# EAGLE board StearnsN (EAGLE 6.6.0)
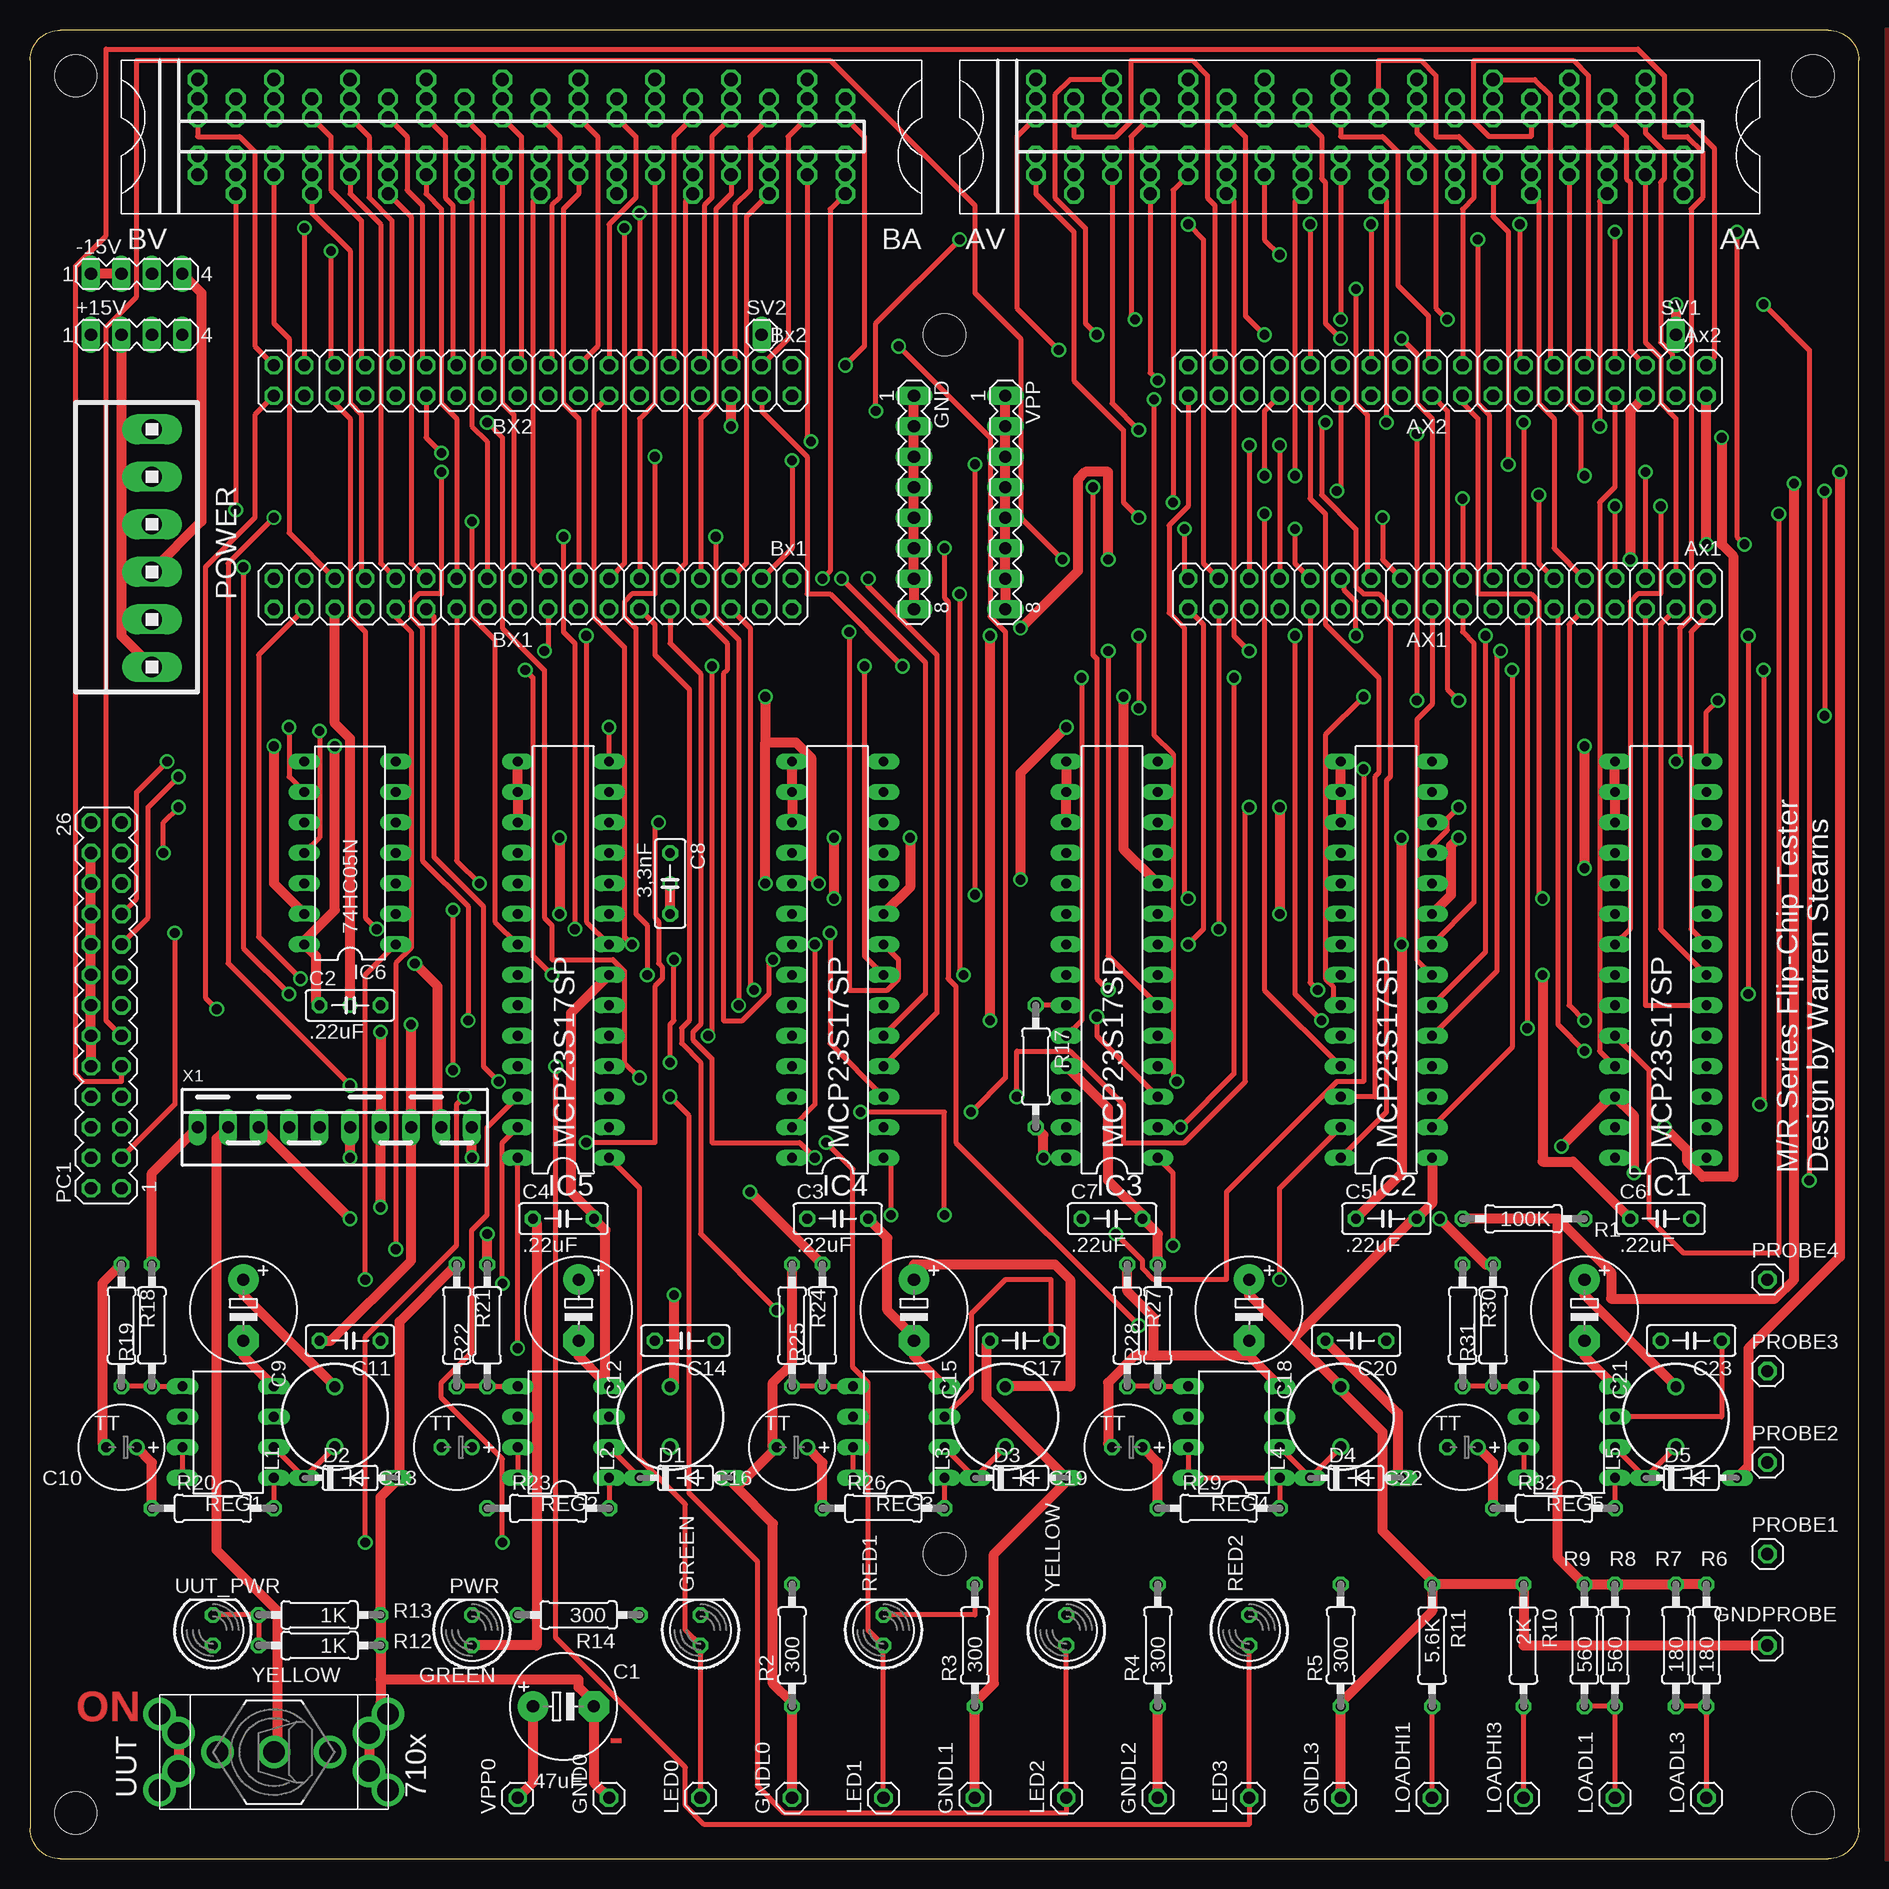
[diagram p1: board, top side]
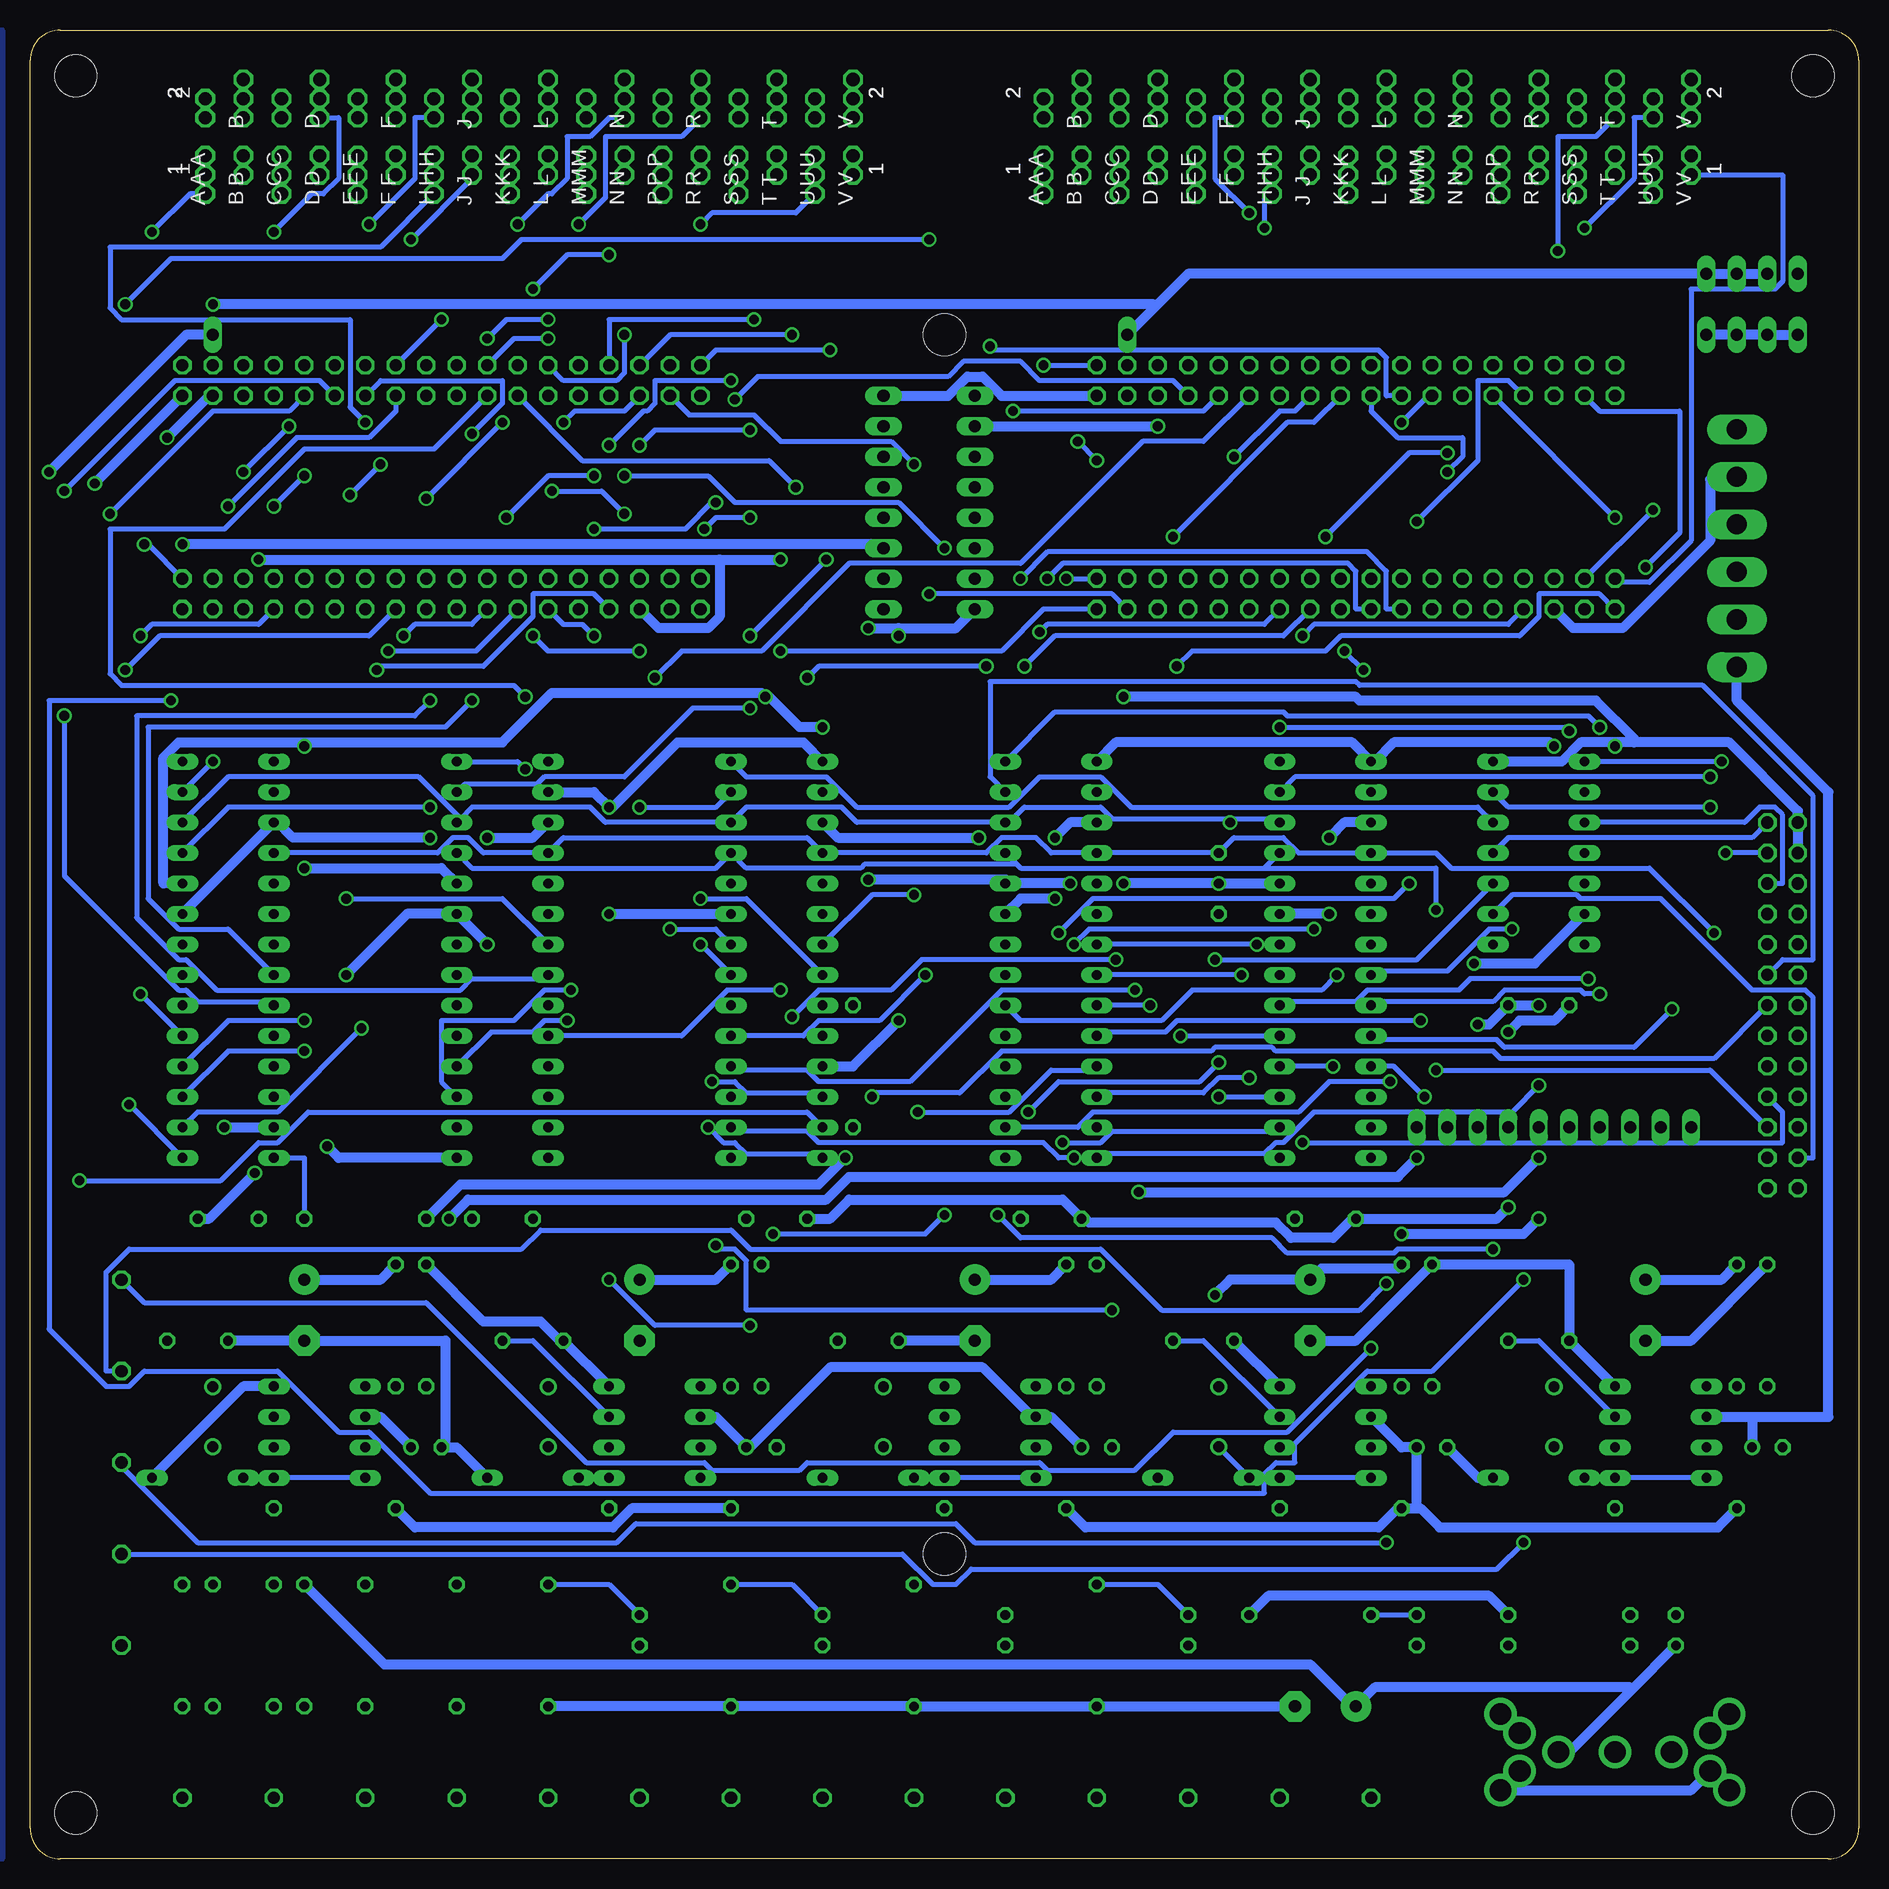
[diagram p2: board, bottom side, seen from below]

Size 152.4 x 152.4 mm. Coordinates in mm from the lower left corner, seen from the top.
Outline: 149.86,152.4 2.54,152.4 arc90 0,149.86 0,2.54 arc90 2.54,0 149.86,0 arc90 152.4,2.54 152.4,149.86 arc90 149.86,152.4
Copper layers (1+16): Top 0.035mm / dielectric 1.5mm / Bottom 0.035mm
Design rules "16mils *": minimum track width 16mil, minimum drill 32mil, track to track 15mil, track to pad 10mil, pad to pad 10mil, via to via 10mil, smd to smd 10mil, copper to edge 13mil, drill to drill 10mil, minimum pad ring 10mil, minimum via ring 8mil, stop-mask expansion 0mil, vias tented up to drill 0mil, thermal gap 10mil
Net classes: 1 Supply: width 0.813 mm
Holes 3.51 mm at 148.59,148.59 3.81,148.59 3.81,3.81 148.59,3.81 76.2,127 76.2,25.4
vRestrict: area 144.8,57.2 to 149.9,87.6

## Footprints (pad centres in the part's own frame; a part is rotated, then mirrored left to right if it is on the bottom)
MA04-1 = drill 1.016 long: 1 -3.81,0; 2 -1.27,0; 3 1.27,0; 4 3.81,0
2X18 = drill 1.016 octagon: 1 -21.59,-1.27; 2 -21.59,1.27; 3 -19.05,-1.27; 4 -19.05,1.27; 5 -16.51,-1.27; 6 -16.51,1.27; 7 -13.97,-1.27; 8 -13.97,1.27; 9 -11.43,-1.27; 10 -11.43,1.27; 11 -8.89,-1.27; 12 -8.89,1.27; 13 -6.35,-1.27; 14 -6.35,1.27; 15 -3.81,-1.27; 16 -3.81,1.27; 17 -1.27,-1.27; 18 -1.27,1.27; 19 1.27,-1.27; 20 1.27,1.27; 21 3.81,-1.27; 22 3.81,1.27; 23 6.35,-1.27; 24 6.35,1.27; 25 8.89,-1.27; 26 8.89,1.27; 27 11.43,-1.27; 28 11.43,1.27; 29 13.97,-1.27; 30 13.97,1.27; 31 16.51,-1.27; 32 16.51,1.27; 33 19.05,-1.27; 34 19.05,1.27; 35 21.59,-1.27; 36 21.59,1.27
E5-8,5 = drill 1.016 pad 2.54: + -2.54,0 | drill 1.016 pad 2.54 octagon: - 2.54,0
C050-025X075 = drill 0.813 octagon: 1 -2.54,0; 2 2.54,0
TT2D7 = drill 0.813: + -1.27,0 | drill 0.813 octagon: - 1.27,0
DO35-7 = drill 0.813 long: A 3.81,0; C -3.81,0
H807-2 = drill 1.092 octagon: AA1 4.763,60.325; AA2 -1.587,60.325; AB1 1.587,57.15; AB2 -4.763,57.15; AC1 4.763,53.975; AC2 -1.587,53.975; AD1 1.587,50.8; AD2 -4.763,50.8; AE1 4.763,47.625; AE2 -1.587,47.625; AF1 1.587,44.45; AF2 -4.763,44.45; AH1 4.763,41.275; AH2 -1.587,41.275; AJ1 1.587,38.1; AJ2 -4.763,38.1; AK1 4.763,34.925; AK2 -1.587,34.925; AL1 1.587,31.75; AL2 -4.763,31.75; AM1 4.763,28.575; AM2 -1.587,28.575; AN1 1.587,25.4; AN2 -4.763,25.4; AP1 4.763,22.225; AP2 -1.587,22.225; AR1 1.587,19.05; AR2 -4.763,19.05; AS1 4.763,15.875; AS2 -1.587,15.875; AT1 1.587,12.7; AT2 -4.763,12.7; AU1 4.763,9.525; AU2 -1.587,9.525; AV1 1.587,6.35; AV2 -4.763,6.35; BA1 4.763,-9.525; BA2 -1.587,-9.525; BB1 1.587,-12.7; BB2 -4.763,-12.7; BC1 4.763,-15.875; BC2 -1.587,-15.875; BD1 1.587,-19.05; BD2 -4.763,-19.05; BE1 4.763,-22.225; BE2 -1.587,-22.225; BF1 1.587,-25.4; BF2 -4.763,-25.4; BH1 4.763,-28.575; BH2 -1.587,-28.575; BJ1 1.587,-31.75; BJ2 -4.763,-31.75; BK1 4.763,-34.925; BK2 -1.587,-34.925; BL1 1.587,-38.1; BL2 -4.763,-38.1; BM1 4.763,-41.275; BM2 -1.587,-41.275; BN1 1.587,-44.45; BN2 -4.763,-44.45; BP1 4.763,-47.625; BP2 -1.587,-47.625; BR1 1.587,-50.8; BR2 -4.763,-50.8; BS1 4.763,-53.975; BS2 -1.587,-53.975; BT1 1.587,-57.15; BT2 -4.763,-57.15; BU1 4.763,-60.325; BU2 -1.587,-60.325; BV1 1.587,-63.5; BV2 -4.763,-63.5
ECS2418-2 = drill 1.092 octagon: AA1 1.587,60.325; AA2 -1.587,60.325; AB1 1.587,57.15; AB2 -1.587,57.15; AC1 1.587,53.975; AC2 -1.587,53.975; AD1 1.587,50.8; AD2 -1.587,50.8; AE1 1.587,47.625; AE2 -1.587,47.625; AF1 1.587,44.45; AF2 -1.587,44.45; AH1 1.587,41.275; AH2 -1.587,41.275; AJ1 1.587,38.1; AJ2 -1.587,38.1; AK1 1.587,34.925; AK2 -1.587,34.925; AL1 1.587,31.75; AL2 -1.587,31.75; AM1 1.587,28.575; AM2 -1.587,28.575; AN1 1.587,25.4; AN2 -1.587,25.4; AP1 1.587,22.225; AP2 -1.587,22.225; AR1 1.587,19.05; AR2 -1.587,19.05; AS1 1.587,15.875; AS2 -1.587,15.875; AT1 1.587,12.7; AT2 -1.587,12.7; AU1 1.587,9.525; AU2 -1.587,9.525; AV1 1.587,6.35; AV2 -1.587,6.35; BA1 1.587,-9.525; BA2 -1.587,-9.525; BB1 1.587,-12.7; BB2 -1.587,-12.7; BC1 1.587,-15.875; BC2 -1.587,-15.875; BD1 1.587,-19.05; BD2 -1.587,-19.05; BE1 1.587,-22.225; BE2 -1.587,-22.225; BF1 1.587,-25.4; BF2 -1.587,-25.4; BH1 1.587,-28.575; BH2 -1.587,-28.575; BJ1 1.587,-31.75; BJ2 -1.587,-31.75; BK1 1.587,-34.925; BK2 -1.587,-34.925; BL1 1.587,-38.1; BL2 -1.587,-38.1; BM1 1.587,-41.275; BM2 -1.587,-41.275; BN1 1.587,-44.45; BN2 -1.587,-44.45; BP1 1.587,-47.625; BP2 -1.587,-47.625; BR1 1.587,-50.8; BR2 -1.587,-50.8; BS1 1.587,-53.975; BS2 -1.587,-53.975; BT1 1.587,-57.15; BT2 -1.587,-57.15; BU1 1.587,-60.325; BU2 -1.587,-60.325; BV1 1.587,-63.5; BV2 -1.587,-63.5
EDAC346-36-2 = drill 1.092 octagon: AA1 3.175,60.325; AA2 -3.175,60.325; AB1 3.175,57.15; AB2 -3.175,57.15; AC1 3.175,53.975; AC2 -3.175,53.975; AD1 3.175,50.8; AD2 -3.175,50.8; AE1 3.175,47.625; AE2 -3.175,47.625; AF1 3.175,44.45; AF2 -3.175,44.45; AH1 3.175,41.275; AH2 -3.175,41.275; AJ1 3.175,38.1; AJ2 -3.175,38.1; AK1 3.175,34.925; AK2 -3.175,34.925; AL1 3.175,31.75; AL2 -3.175,31.75; AM1 3.175,28.575; AM2 -3.175,28.575; AN1 3.175,25.4; AN2 -3.175,25.4; AP1 3.175,22.225; AP2 -3.175,22.225; AR1 3.175,19.05; AR2 -3.175,19.05; AS1 3.175,15.875; AS2 -3.175,15.875; AT1 3.175,12.7; AT2 -3.175,12.7; AU1 3.175,9.525; AU2 -3.175,9.525; AV1 3.175,6.35; AV2 -3.175,6.35; BA1 3.175,-9.525; BA2 -3.175,-9.525; BB1 3.175,-12.7; BB2 -3.175,-12.7; BC1 3.175,-15.875; BC2 -3.175,-15.875; BD1 3.175,-19.05; BD2 -3.175,-19.05; BE1 3.175,-22.225; BE2 -3.175,-22.225; BF1 3.175,-25.4; BF2 -3.175,-25.4; BH1 3.175,-28.575; BH2 -3.175,-28.575; BJ1 3.175,-31.75; BJ2 -3.175,-31.75; BK1 3.175,-34.925; BK2 -3.175,-34.925; BL1 3.175,-38.1; BL2 -3.175,-38.1; BM1 3.175,-41.275; BM2 -3.175,-41.275; BN1 3.175,-44.45; BN2 -3.175,-44.45; BP1 3.175,-47.625; BP2 -3.175,-47.625; BR1 3.175,-50.8; BR2 -3.175,-50.8; BS1 3.175,-53.975; BS2 -3.175,-53.975; BT1 3.175,-57.15; BT2 -3.175,-57.15; BU1 3.175,-60.325; BU2 -3.175,-60.325; BV1 3.175,-63.5; BV2 -3.175,-63.5
MA08-1 = drill 1.016 long: 1 -8.89,0; 2 -6.35,0; 3 -3.81,0; 4 -1.27,0; 5 1.27,0; 6 3.81,0; 7 6.35,0; 8 8.89,0
1X01 = drill 1.016 octagon: 1 0,0
LED5MM = drill 0.813 octagon: A -1.27,0; K 1.27,0
DIL28-3 = drill 0.813 long: 1 -16.51,-3.81; 2 -13.97,-3.81; 3 -11.43,-3.81; 4 -8.89,-3.81; 5 -6.35,-3.81; 6 -3.81,-3.81; 7 -1.27,-3.81; 8 1.27,-3.81; 9 3.81,-3.81; 10 6.35,-3.81; 11 8.89,-3.81; 12 11.43,-3.81; 13 13.97,-3.81; 14 16.51,-3.81; 15 16.51,3.81; 16 13.97,3.81; 17 11.43,3.81; 18 8.89,3.81; 19 6.35,3.81; 20 3.81,3.81; 21 1.27,3.81; 22 -1.27,3.81; 23 -3.81,3.81; 24 -6.35,3.81; 25 -8.89,3.81; 26 -11.43,3.81; 27 -13.97,3.81; 28 -16.51,3.81
DIL14 = drill 0.813 long: 1 -7.62,-3.81; 2 -5.08,-3.81; 3 -2.54,-3.81; 4 0,-3.81; 5 2.54,-3.81; 6 5.08,-3.81; 7 7.62,-3.81; 8 7.62,3.81; 9 5.08,3.81; 10 2.54,3.81; 11 0,3.81; 12 -2.54,3.81; 13 -5.08,3.81; 14 -7.62,3.81
6000-XXXX-RC = drill 0.9 pad 1.422: 1 -2.5,0; 2 2.5,0
MA13-2 = drill 1.016 octagon: 1 -15.24,-1.27; 2 -15.24,1.27; 3 -12.7,-1.27; 4 -12.7,1.27; 5 -10.16,-1.27; 6 -10.16,1.27; 7 -7.62,-1.27; 8 -7.62,1.27; 9 -5.08,-1.27; 10 -5.08,1.27; 11 -2.54,-1.27; 12 -2.54,1.27; 13 0,-1.27; 14 0,1.27; 15 2.54,-1.27; 16 2.54,1.27; 17 5.08,-1.27; 18 5.08,1.27; 19 7.62,-1.27; 20 7.62,1.27; 21 10.16,-1.27; 22 10.16,1.27; 23 12.7,-1.27; 24 12.7,1.27; 25 15.24,-1.27; 26 15.24,1.27
1X6MTA = drill 1.676 long: 1 9.906,0; 2 5.944,0; 3 1.981,0; 4 -1.981,0; 5 -5.944,0; 6 -9.906,0
0207/10 = drill 0.813 octagon: 1 -5.08,0; 2 5.08,0
DIL08 = drill 0.813 long: 1 -3.81,-3.81; 2 -1.27,-3.81; 3 1.27,-3.81; 4 3.81,-3.81; 5 3.81,3.81; 6 1.27,3.81; 7 -1.27,3.81; 8 -3.81,3.81
MA01-1 = drill 1.016 long: 1 0,0
7109MD9V3 = drill 1.803: 1 0,4.699; 2 0,0; 3 0,-4.699; NC@1 -3.175,9.525; NC@2 -1.587,7.938; NC@3 3.175,9.525; NC@4 1.587,7.938; NC@5 -3.175,-9.525; NC@6 -1.587,-7.938; NC@7 1.587,-7.938; NC@8 3.175,-9.525
22-23-2101 = drill 1 long: 1 -11.43,0; 2 -8.89,0; 3 -6.35,0; 4 -3.81,0; 5 -1.27,0; 6 1.27,0; 7 3.81,0; 8 6.35,0; 9 8.89,0; 10 11.43,0

## Placement (x,y rotation side)
+15V  [MA04-1]  8.89,127 0 top
-15V  [MA04-1]  8.89,132.08 0 top
AX1  Ax1  [2X18]  118.11,105.41 180 top
AX2  Ax2  [2X18]  118.11,123.19 180 top
BX1  Bx1  [2X18]  41.91,105.41 180 top
BX2  Bx2  [2X18]  41.91,123.19 180 top
C1  47uF  [E5-8,5]  44.45,12.7 0 top
C2  .22uF  [C050-025X075]  26.67,71.12 0 top
C3  .22uF  [C050-025X075]  67.31,53.34 0 top
C4  .22uF  [C050-025X075]  44.45,53.34 0 top
C5  .22uF  [C050-025X075]  113.03,53.34 0 top
C6  .22uF  [C050-025X075]  135.89,53.34 0 top
C7  .22uF  [C050-025X075]  90.17,53.34 0 top
C8  3,3nF  [C050-025X075]  53.34,81.28 270 top
C9  470uF  [E5-8,5]  17.78,45.72 270 top
C10  100uF  [TT2D7]  7.62,34.29 180 top
C11  .22uF  [C050-025X075]  26.67,43.18 180 top
C12  470uF  [E5-8,5]  45.72,45.72 270 top
C13  100uF  [TT2D7]  35.56,34.29 180 top
C14  .22uF  [C050-025X075]  54.61,43.18 180 top
C15  470uF  [E5-8,5]  73.66,45.72 270 top
C16  100uF  [TT2D7]  63.5,34.29 180 top
C17  .22uF  [C050-025X075]  82.55,43.18 180 top
C18  470uF  [E5-8,5]  101.6,45.72 270 top
C19  100uF  [TT2D7]  91.44,34.29 180 top
C20  .22uF  [C050-025X075]  110.49,43.18 180 top
C21  470uF  [E5-8,5]  129.54,45.72 270 top
C22  100uF  [TT2D7]  119.38,34.29 180 top
C23  .22uF  [C050-025X075]  138.43,43.18 180 top
D1  1N5819  [DO35-7]  54.61,31.75 0 top
D2  1N5819  [DO35-7]  26.67,31.75 0 top
D3  1N5819  [DO35-7]  82.55,31.75 0 top
D4  1N5819  [DO35-7]  110.49,31.75 0 top
D5  1N5819  [DO35-7]  138.43,31.75 0 top
DEC  W971  [H807-2]  77.47,143.51 270 top
ECS  W971ECS  [ECS2418-2]  77.47,143.51 270 top
EDAC  W971EDAC  [EDAC346-36-2]  77.47,143.51 270 top
GND  [MA08-1]  73.66,113.03 270 top
GND0  [1X01]  48.26,5.08 90 top
GNDL0  [1X01]  63.5,5.08 90 top
GNDL1  [1X01]  78.74,5.08 90 top
GNDL2  [1X01]  93.98,5.08 90 top
GNDL3  [1X01]  109.22,5.08 90 top
GNDPROBE  [1X01]  144.78,17.78 180 top
GREEN  [LED5MM]  55.88,19.05 90 top
IC1  MCP23S17SP  [DIL28-3]  135.89,74.93 90 top
IC2  MCP23S17SP  [DIL28-3]  113.03,74.93 90 top
IC3  MCP23S17SP  [DIL28-3]  90.17,74.93 90 top
IC4  MCP23S17SP  [DIL28-3]  67.31,74.93 90 top
IC5  MCP23S17SP  [DIL28-3]  44.45,74.93 90 top
IC6  74HC05N  [DIL14]  26.67,83.82 90 top
L1  220uH  [6000-XXXX-RC]  25.4,36.83 90 top
L2  220uH  [6000-XXXX-RC]  53.34,36.83 90 top
L3  220uH  [6000-XXXX-RC]  81.28,36.83 90 top
L4  220uH  [6000-XXXX-RC]  109.22,36.83 90 top
L5  220uH  [6000-XXXX-RC]  137.16,36.83 90 top
LED0  [1X01]  55.88,5.08 90 top
LED1  [1X01]  71.12,5.08 90 top
LED2  [1X01]  86.36,5.08 90 top
LED3  [1X01]  101.6,5.08 90 top
LOADHI1  [1X01]  116.84,5.08 90 top
LOADHI3  [1X01]  124.46,5.08 90 top
LOADL1  [1X01]  132.08,5.08 90 top
LOADL3  [1X01]  139.7,5.08 90 top
PC1  [MA13-2]  6.35,71.12 90 top
POWER  [1X6MTA]  10.16,109.22 90 top
PROBE1  [1X01]  144.78,25.4 0 top
PROBE2  [1X01]  144.78,33.02 0 top
PROBE3  [1X01]  144.78,40.64 0 top
PROBE4  [1X01]  144.78,48.26 0 top
PWR  GREEN  [LED5MM]  36.83,19.05 90 top
R1  100K  [0207/10]  124.46,53.34 180 top
R2  300  [0207/10]  63.5,17.78 90 top
R3  300  [0207/10]  78.74,17.78 90 top
R4  300  [0207/10]  93.98,17.78 90 top
R5  300  [0207/10]  109.22,17.78 90 top
R6  180  [0207/10]  139.7,17.78 90 top
R7  180  [0207/10]  137.16,17.78 90 top
R8  560  [0207/10]  132.08,17.78 90 top
R9  560  [0207/10]  129.54,17.78 90 top
R10  2K  [0207/10]  124.46,17.78 270 top
R11  5.6K  [0207/10]  116.84,17.78 270 top
R12  1K  [0207/10]  24.13,17.78 180 top
R13  1K  [0207/10]  24.13,20.32 180 top
R14  300  [0207/10]  45.72,20.32 180 top
R17  100K  [0207/10]  83.82,66.04 270 top
R18  1.2K  [0207/10]  7.62,44.45 270 top
R19  3.6K  [0207/10]  10.16,44.45 90 top
R20  0.33  [0207/10]  15.24,29.21 0 top
R21  1.2K  [0207/10]  35.56,44.45 270 top
R22  8.4K  [0207/10]  38.1,44.45 90 top
R23  0.33  [0207/10]  43.18,29.21 0 top
R24  1.2K  [0207/10]  63.5,44.45 270 top
R25  2K  [0207/10]  66.04,44.45 90 top
R26  0.33  [0207/10]  71.12,29.21 0 top
R27  1.2K  [0207/10]  91.44,44.45 270 top
R28  13.2K  [0207/10]  93.98,44.45 90 top
R29  0.33  [0207/10]  99.06,29.21 0 top
R30  1.2K  [0207/10]  119.38,44.45 270 top
R31  9.8K  [0207/10]  121.92,44.45 90 top
R32  0.33  [0207/10]  127,29.21 0 top
RED1  [LED5MM]  71.12,19.05 90 top
RED2  [LED5MM]  101.6,19.05 90 top
REG1  MC33063/MC34063P  [DIL08]  16.51,35.56 90 top
REG2  MC33063/MC34063P  [DIL08]  44.45,35.56 90 top
REG3  MC33063/MC34063P  [DIL08]  72.39,35.56 90 top
REG4  MC33063/MC34063P  [DIL08]  100.33,35.56 90 top
REG5  MC33063/MC34063P  [DIL08]  128.27,35.56 90 top
SV1  MA01-1  [MA01-1]  137.16,127 0 top
SV2  MA01-1  [MA01-1]  60.96,127 0 top
UUT  710x  [7109MD9V3]  20.32,8.89 90 top
UUT_PWR  YELLOW  [LED5MM]  15.24,19.05 90 top
VPP  [MA08-1]  81.28,113.03 270 top
VPP0  [1X01]  40.64,5.08 90 top
X1  CONFIG  [22-23-2101]  25.4,60.96 0 top
YELLOW  [LED5MM]  86.36,19.05 90 top

## Tracks (layer width: path | path; a pad name or v marks a point on that pad's centre or on a via)
3.5V  (via drill 0.81)
  Top 0.813: C15.+ 73.66,49.53 85.41,49.53 86.68,48.26 86.68,39.37 81.28,39.37 L3.2 | v26.67,58.42 X1.6 | R25.2 v60.01,55.56
  Bottom 0.813: R25.2 67.31,48.26 C15.+ | v26.67,58.42 29.53,55.56 v60.01,55.56
+5V
  Top 0.813: C9.+ 17.78,46.99 25.4,39.37 L1.2 | X1.1 10.16,57.15 R19.2
  Bottom 0.813: R19.2 11.43,48.26 C9.+
+10V  (via drill 0.81)
  Top 0.813: v53.66,46.99 53.66,39.69 53.34,39.37 L2.2 | v26.67,53.34 X1.3 | R22.2 v38.1,52.07
  Bottom 0.813: R22.2 38.42,49.21 44.77,49.21 C12.+ 52.39,48.26 v53.66,46.99 | v26.67,53.34 27.94,52.07 v38.1,52.07
+15V
  Top 0.813: +15V.2 7.62,101.92 10.16,99.38 POWER.6 | C19.+ 93.98,33.02 R29.1 | C22.+ 121.92,33.02 R32.1 | C10.+ 10.16,33.02 R20.1 | C16.+ 66.04,33.02 R26.1
  Bottom 0.813: +15V.1 +15V.2 +15V.3 +15V.4 | R20.1 11.75,27.62 34.92,27.62 36.51,29.21 36.83,29.21 | 36.83,29.21 R23.1 38.42,29.21 40.01,27.62 64.45,27.62 R26.1 | R32.1 120.33,27.62 103.82,27.62 102.23,29.21 R29.1 | POWER.6 10.16,96.52 2.54,88.9 2.54,36.83 8.89,36.83 | REG1.6 8.89,36.83 | C22.+ 123.19,36.83 REG5.6 | REG4.6 95.25,36.83 C19.+ 92.39,34.29 85.72,40.96 73.03,40.96 68.9,36.83 REG3.6 67.31,36.83 C16.+ | 8.89,36.83 C10.+ | 36.83,29.21 C13.+ 38.1,34.29 REG2.6
-3.5V  (via drill 0.81)
  Top 0.813: C21.+ 129.54,46.99 137.16,39.37 L5.2 | v36.83,58.42 X1.10 | v117.47,53.34 121.28,49.53 R31.2
  Bottom 0.813: R31.2 123.19,48.26 C21.+ | v36.83,58.42 38.42,56.83 84.14,56.83 86.04,54.93 115.89,54.93 v117.47,53.34
-15V  (via drill 0.81)
  Top 0.813: REG5.4 129.54,41.91 C21.- | 101.6,41.91 REG4.4 | C18.- 101.6,41.91 | -15V.2 -15V.1 | v137.16,129.54 SV1.1 | -15V.4 14.29,130.49 14.29,111.44 10.16,107.31 POWER.4 | D5.A 143.19,32.7 143.19,42.55 150.81,50.16 v150.81,115.57 | C19.- 89.85,34.61 89.85,39.69 92.08,41.91 93.66,41.91 | 101.6,41.91 93.66,41.91 | R27.1 91.44,47.31 93.66,45.09 93.66,41.91 | D4.A 113.98,32.07 113.98,37.15 C20.2
  Bottom 0.813: D5.A 134.62,39.37 REG5.4 | C23.2 C21.- 117.79,43.18 117.79,34.61 C22.- 116.84,34.29 D4.A | REG4.4 C20.2 108.27,43.18 109.86,44.77 114.62,44.77 R30.1 | 58.58,129.38 55.88,132.08 -15V.4 -15V.3 -15V.2 | 58.58,129.38 SV2.1 | v137.16,129.54 58.74,129.54 58.58,129.38 | v150.81,115.57 139.38,127 SV1.1
AA1J
  Top 0.406: IC1.8 138.43,77.47 138.43,102.23 139.7,103.5 AX1.2
AB1J
  Top 0.406: IC1.7 135.89,77.47 135.89,102.87 AX1.4
AB2J  (via drill 0.81)
  Top 0.813: v136.21,60.96 138.11,59.05 138.11,58.1 139.38,56.83 141.92,56.83 141.92,108.58 140.97,109.54 v140.97,118.43
  Bottom 0.813: v136.21,60.96 IC1.27 | v140.97,118.43 137.48,121.92 AX2.4
AC1J
  Top 0.406: IC1.6 134.62,71.12 AX1.6
AD1J  (via drill 0.81)
  Top 0.406: v143.19,101.92 v143.19,72.07
  Bottom 0.406: v143.19,72.07 IC1.5 | v143.19,101.92 142.24,102.87 133.35,102.87 AX1.8
AD2J
  Top 0.406: IC1.25 130.81,67.31 130.81,113.03 132.08,114.3 AX2.8
AE1J  (via drill 0.81)
  Top 0.406: v129.54,69.85 128.27,71.12 128.27,102.87 AX1.10
  Bottom 0.406: IC1.4 135.89,69.85 v129.54,69.85
AE2J  (via drill 0.81)
  Top 0.406: IC1.24 134.94,65.72 134.94,53.34 137.79,50.48 145.73,50.48 v145.73,112.08
  Bottom 0.406: v145.73,112.08 137.16,120.65 130.81,120.65 AX2.10
AF1J  (via drill 0.81)
  Top 0.406: v129.54,67.31 127.32,69.53 127.32,103.82 AX1.12
  Bottom 0.406: IC1.3 135.89,67.31 v129.54,67.31
AF2J  (via drill 0.81)
  Top 0.406: v149.54,113.98 v149.54,95.25
  Bottom 0.406: IC1.23 132.4,71.44 138.43,71.44 139.38,72.39 140.02,72.39 149.54,81.92 v149.54,95.25 | v149.54,113.98 140.34,123.19 128.27,123.19 AX2.12
AH1J  (via drill 0.81)
  Top 0.406: v124.78,69.22 124.78,103.82 AX1.14
  Bottom 0.406: IC1.2 138.43,62.23 131.76,62.23 v124.78,69.22
AH2J  (via drill 0.81)
  Top 0.406: v115.57,118.75 v115.57,96.52
  Bottom 0.406: IC1.22 135.89,77.47 140.02,77.47 142.56,80.01 142.56,94.3 117.79,94.3 v115.57,96.52 | v115.57,118.75 113.03,121.28 113.03,123.19 123.19,123.19 AX2.14
AJ1J  (via drill 0.81)
  Top 0.406: v144.15,62.87 144.46,63.18 v144.46,99.06
  Bottom 0.406: v144.15,62.87 IC1.1 | v144.46,99.06 141.6,101.92 124.14,101.92 AX1.16
AJ2J  (via drill 0.81)
  Top 0.406: IC1.21 133.35,77.47 133.35,104.78 133.99,105.41 135.89,105.41 v135.89,112.71
  Bottom 0.406: v135.89,112.71 130.18,118.43 124.14,118.43 121.92,120.65 AX2.16
AK1J
  Top 0.406: IC2.8 120.33,79.69 120.33,101.28 119.38,102.23 AX1.18
AK2J  (via drill 0.81)
  Top 0.406: v126.05,80.01 125.73,80.33 125.73,104.78 125.09,105.41 120.65,105.41 120.65,120.02 119.38,121.28 AX2.18
  Bottom 0.406: IC2.21 113.03,80.01 v126.05,80.01
AL1J
  Top 0.406: IC2.7 115.57,74.93 115.57,94.93 116.84,96.2 AX1.20
AL2J  (via drill 0.81)
  Top 0.406: v119.06,96.52 118.11,97.47 118.11,120.65 AX2.20
  Bottom 0.406: IC2.22 109.54,73.34 115.57,73.34 116.52,72.39 136.84,72.39 139.38,74.93 140.02,74.93 143.51,78.42 143.51,95.25 120.33,95.25 v119.06,96.52
AM1J  (via drill 0.81)
  Top 0.406: IC2.6 121.28,75.56 v121.28,101.92
  Bottom 0.406: v121.28,101.92 120.33,102.87 115.57,102.87 AX1.22
AM2J  (via drill 0.81)
  Top 0.406: IC2.23 108.58,71.75 108.58,72.71 107.95,73.34 107.95,93.66 v111.12,96.84
  Bottom 0.406: v111.12,96.84 112.08,97.79 144.78,97.79 145.73,98.74 145.73,110.81 136.21,110.81 129.54,117.47 118.75,117.47 AX2.22
AN1J  (via drill 0.81)
  Top 0.406: IC2.5 122.24,73.98 122.24,100.33 v122.56,100.65
  Bottom 0.406: v122.56,100.65 115.25,100.65 AX1.24
AN2J  (via drill 0.81)
  Top 0.406: v89.85,72.39 88.9,73.34 88.9,100.01 88.58,100.33 v88.58,114.3
  Bottom 0.406: IC2.24 98.11,68.58 94.3,72.39 v89.85,72.39 | v88.58,114.3 90.81,116.52 106.36,116.52 AX2.24
AP1J  (via drill 0.81)
  Top 0.406: v107.63,69.85 105.41,72.07 v105.41,101.92
  Bottom 0.406: IC2.4 113.98,68.9 110.49,68.9 109.54,69.85 v107.63,69.85 | v105.41,101.92 106.36,102.87 107.95,102.87 AX1.26
AP2J  (via drill 0.81)
  Top 0.406: IC2.25 102.87,72.39 v102.87,112.08 | v108.9,113.98 109.22,114.3 AX2.26
  Bottom 0.406: v102.87,112.08 104.78,113.98 v108.9,113.98
AR1J  (via drill 0.81)
  Top 0.406: v107.31,72.39 106.68,73.03 AX1.28
  Bottom 0.406: IC2.3 118.11,64.77 118.11,69.85 112.08,69.85 109.54,72.39 v107.31,72.39
AR2J
  Top 0.406: IC2.26 112.08,63.5 112.08,90.17 112.39,90.49 112.39,98.42 107.95,102.87 107.95,112.08 106.68,113.35 AX2.28
AS1J  (via drill 0.81)
  Top 0.406: IC2.2 123.51,67.63 v123.51,99.06
  Bottom 0.406: v123.51,99.06 123.19,99.38 114.62,99.38 110.49,103.5 110.49,105.41 105.41,105.41 AX1.30
AS2J  (via drill 0.81)
  Top 0.406: IC2.27 104.14,55.88 v104.14,48.26 | v92.39,44.45 77.15,59.69 77.15,72.71 76.52,73.34 76.52,104.78 76.2,105.09 v76.2,109.22 | v102.87,115.25 102.87,120.65 AX2.30
  Bottom 0.406: v104.14,48.26 100.33,44.45 v92.39,44.45 | v76.2,109.22 80.01,113.03 93.66,113.03 95.89,115.25 v102.87,115.25
AT2J  (via drill 0.81)
  Top 0.406: IC2.28 113.03,62.23 113.03,89.85 113.35,90.17 113.35,103.19 113.03,103.5 113.03,104.78 112.39,105.41 111.12,105.41 110.49,106.05 110.49,110.81 107.63,113.67 107.63,119.38 v107.95,119.7
  Bottom 0.406: v107.95,119.7 107,120.65 102.87,120.65 AX2.32
AU1J  (via drill 0.81)
  Top 0.406: AX1.34 v99.06,77.47
  Bottom 0.406: IC3.8 95.25,77.47 v99.06,77.47
AU2J  (via drill 0.81)
  Top 0.406: v78.74,116.2 v78.74,80.33
  Bottom 0.406: IC3.21 82.23,80.33 v78.74,80.33 | v78.74,116.2 80.64,118.11 89.85,118.11 92.08,120.33 97.47,120.33 AX2.34
AV1J  (via drill 0.81)
  Top 0.406: v96.52,76.2 97.79,77.47 97.79,102.87 AX1.36
  Bottom 0.406: v96.52,76.2 IC3.7
AV2J  (via drill 0.81)
  Top 0.406: v96.52,80.01 96.2,80.33 96.2,102.55 94.93,103.82 94.93,111.12 96.52,112.71 AX2.36
  Bottom 0.406: IC3.22 92.71,80.01 v96.52,80.01
BA1J  (via drill 0.81)
  Top 0.406: IC3.6 89.85,75.25 v89.85,100.65
  Bottom 0.406: v89.85,100.65 71.44,100.65 67.94,104.14 BX1.2
BB1J  (via drill 0.81)
  Top 0.406: v77.79,73.66 77.47,73.98 v77.47,105.41
  Bottom 0.406: IC3.5 87.95,68.58 86.68,69.85 81.6,69.85 v77.79,73.66 | v77.47,105.41 62.23,105.41 BX1.4
BB2J  (via drill 0.81)
  Top 0.406: IC3.24 87.63,69.85 v87.63,98.42 | v72.71,99.38 66.67,105.41 64.77,105.41 64.77,116.84 60.96,120.65 BX2.4
  Bottom 0.406: v87.63,98.42 86.68,99.38 v72.71,99.38
BC1J  (via drill 0.81)
  Top 0.406: v60.33,72.39 60.01,72.71 60.01,102.55 BX1.6
  Bottom 0.406: IC3.4 93.66,65.72 87.63,65.72 86.68,64.77 79.06,64.77 71.44,72.39 v60.33,72.39
BD1J  (via drill 0.81)
  Top 0.406: IC3.3 88.9,68.58 v88.9,70.17 | v61.91,74.93 61.59,74.61 61.59,72.07 59.37,69.85 57.78,69.85 57.78,98.74 58.1,99.06 58.1,101.28 55.88,103.5 BX1.8
  Bottom 0.406: v88.9,70.17 86.68,72.39 80.64,72.39 78.11,74.93 v61.91,74.93
BD2J  (via drill 0.81)
  Top 0.406: v95.57,64.77 95.25,65.09 95.25,92.08 93.66,93.66 v93.66,121.6
  Bottom 0.406: IC3.26 86.68,63.82 92.71,63.82 93.66,64.77 v95.57,64.77 | v93.66,121.6 91.76,123.51 75.88,123.51 74.61,124.78 69.85,124.78 68.26,123.19 57.15,123.19 BX2.8
BE1J  (via drill 0.81)
  Top 0.406: v65.41,58.42 64.14,59.69 56.83,59.69 56.83,66.67 55.24,68.26 55.24,68.9 55.88,69.53 55.88,98.74 53.34,101.28 BX1.10
  Bottom 0.406: IC3.2 93.66,60.64 87.63,60.64 86.68,59.69 67.94,59.69 66.67,58.42 v65.41,58.42
BE2J  (via drill 0.81)
  Top 0.406: v148.27,56.52 148.27,125.73 v144.46,129.54 | v77.47,134.94 70.48,127.95 v70.48,120.65
  Bottom 0.406: IC3.27 87.63,62.23 129.22,62.23 131.76,59.69 133.35,59.69 136.53,56.52 v148.27,56.52 | v144.46,129.54 140.65,133.35 113.03,133.35 111.44,134.94 v77.47,134.94 | v70.48,120.65 54.61,120.65 BX2.10
BF1J  (via drill 0.81)
  Top 0.406: IC3.1 95.25,57.15 v95.25,51.12 | v62.23,45.72 55.88,52.07 55.88,66.36 54.29,67.94 54.29,69.22 54.93,69.85 54.93,97.47 52.07,100.33 52.07,102.87 BX1.12
  Bottom 0.406: v95.25,51.12 94.93,50.8 93.66,50.8 92.71,49.85 92.71,45.72 v62.23,45.72
BF2J  (via drill 0.81)
  Top 0.406: v95.89,60.96 100.33,65.41 v100.33,98.42
  Bottom 0.406: IC3.28 86.68,58.74 92.71,58.74 93.66,59.69 94.61,59.69 v95.89,60.96 | v100.33,98.42 98.11,100.65 91.44,100.65 84.14,107.95 69.85,107.95 59.69,118.11 54.61,118.11 BX2.12
BH1J  (via drill 0.81)
  Top 0.406: IC4.8 72.39,74.93 72.39,73.34 71.44,72.39 68.26,72.39 v68.26,102.23
  Bottom 0.406: v68.26,102.23 67.63,102.87 49.53,102.87 BX1.14
BH2J  (via drill 0.81)
  Top 0.406: v50.16,76.2 49.53,76.83 49.53,100.97 46.99,103.5 46.99,120.65 BX2.14
  Bottom 0.406: v50.16,76.2 IC4.21
BJ1J  (via drill 0.81)
  Top 0.406: IC4.7 69.53,75.25 v69.53,99.38
  Bottom 0.406: v69.53,99.38 66.99,101.92 47.94,101.92 BX1.16
BJ2J  (via drill 0.81)
  Top 0.406: v51.44,73.66 51.44,77.79 50.48,78.74 50.48,102.55 49.53,103.5 49.53,104.78 50.16,105.41 52.07,105.41 v52.07,116.84
  Bottom 0.406: v51.44,73.66 IC4.22 | v52.07,116.84 48.26,120.65 46.99,120.65 BX2.16
BK1J  (via drill 0.81)
  Top 0.406: v43.5,73.66 41.91,75.25 41.91,98.42 v41.27,99.06 | v42.86,100.65 43.18,100.97 BX1.18
  Bottom 0.406: IC4.6 69.85,69.85 58.1,69.85 55.56,72.39 44.77,72.39 v43.5,73.66 | v42.86,100.65 v41.27,99.06
BK2J  (via drill 0.81)
  Top 0.406: v59.05,71.12 59.05,101.6 57.15,103.5 v57.15,110.17
  Bottom 0.406: v59.05,71.12 IC4.23 | v57.15,110.17 47.62,119.7 45.4,119.7 BX2.18
BL1J  (via drill 0.81)
  Top 0.406: IC4.5 74.61,72.07 74.61,99.69 v67.63,106.68
  Bottom 0.406: v67.63,106.68 66.36,107.95 42.55,107.95 41.91,107.31 41.91,104.14 BX1.20
BL2J  (via drill 0.81)
  Top 0.406: v36.51,69.85 36.51,79.38 32.7,83.19 32.7,102.55 31.75,103.5 31.75,104.78 32.38,105.41 34.29,105.41 v34.29,115.57
  Bottom 0.406: IC4.24 63.18,68.9 57.78,68.9 56.83,69.85 v36.51,69.85 | v34.29,115.57 33.02,116.84 33.02,118.43 38.42,118.43 40.64,120.65 BX2.20
BM1J  (via drill 0.81)
  Top 0.406: IC4.4 75.56,70.48 75.56,100.33 69.85,106.05 v69.85,106.68
  Bottom 0.406: v69.85,106.68 67.63,108.9 40.96,108.9 39.37,107.31 39.37,104.14 BX1.22
BM2J  (via drill 0.81)
  Top 0.406: v78.42,62.23 81.28,65.09 81.28,102.23 80.01,103.5 80.01,118.43 v72.39,126.05
  Bottom 0.406: IC4.25 63.82,65.72 67.31,65.72 70.8,62.23 v78.42,62.23 | v72.39,126.05 72.07,125.73 40.01,125.73 39.37,125.09 39.37,121.92 BX2.22
BN1J  (via drill 0.81)
  Top 0.406: IC4.3 66.67,67.94 v66.67,77.15 | v37.47,81.28 35.56,83.19 BX1.24
  Bottom 0.406: v66.67,77.15 63.82,80.01 38.73,80.01 v37.47,81.28
BN2J  (via drill 0.81)
  Top 0.406: v50.8,65.09 49.53,66.36 49.53,73.98 48.58,74.93 43.5,74.93 43.5,77.79 42.86,78.42 42.86,99.06 39.37,102.55 39.37,118.43 v38.1,119.7
  Bottom 0.406: IC4.26 63.18,63.82 54.61,63.82 53.34,65.09 v50.8,65.09 | v38.1,119.7 35.88,121.92 BX2.24
BP1J  (via drill 0.81)
  Top 0.406: v39.05,64.77 37.78,66.04 37.78,79.38 33.66,83.5 33.66,103.5 BX1.26
  Bottom 0.406: IC4.2 65.09,60.96 63.82,62.23 46.67,62.23 44.13,64.77 v39.05,64.77
BP2J  (via drill 0.81)
  Top 0.406: IC4.27 65.41,62.87 v65.41,76.2 | v45.4,77.47 45.4,101.28 44.45,102.23 v44.45,110.17 | v34.29,117.16 33.02,118.43 BX2.26
  Bottom 0.406: v65.41,76.2 64.14,77.47 v45.4,77.47 | v44.45,110.17 37.47,117.16 v34.29,117.16
BR1J  (via drill 0.81)
  Top 0.406: IC4.1 71.75,57.78 v71.75,53.66 | v30.48,50.8 30.48,74.61 31.75,75.88 31.75,102.23 30.48,103.5 BX1.28
  Bottom 0.406: v71.75,53.66 69.85,51.75 48.9,51.75 47.62,50.48 38.73,50.48 38.42,50.8 v30.48,50.8
BR2J  (via drill 0.81)
  Top 0.406: v26.67,64.45 16.51,74.61 16.51,107.95 v20.32,111.76
  Bottom 0.406: IC4.28 63.18,58.74 49.53,58.74 48.58,59.69 47.94,59.69 45.4,62.23 28.89,62.23 v26.67,64.45 | BX2.28 v20.32,111.76
BS1J  (via drill 0.81)
  Top 0.406: IC5.8 46.35,78.11 v46.35,101.92
  Bottom 0.406: v46.35,101.92 45.4,102.87 29.21,102.87 BX1.30
BS2J  (via drill 0.81)
  Top 0.406: IC5.21 38.73,78.11 38.73,101.6 36.83,103.5 v36.83,111.44
  Bottom 0.406: v36.83,111.44 31.75,116.52 31.75,123.19 29.21,123.19 BX2.30
BT2J  (via drill 0.81)
  Top 0.406: v28.89,77.47 27.94,78.42 27.94,102.23 26.67,103.5 26.67,120.02 25.4,121.28 BX2.32
  Bottom 0.406: IC5.22 40.32,73.98 34.29,73.98 30.8,77.47 v28.89,77.47
BU1J  (via drill 0.81)
  Top 0.406: v22.54,73.34 19.05,76.83 19.05,100.33 BX1.34
  Bottom 0.406: IC5.6 47.94,71.44 41.91,71.44 40.96,72.39 33.34,72.39 32.38,73.34 v22.54,73.34
BU2J  (via drill 0.81)
  Top 0.406: v21.59,72.07 17.78,75.88 v17.78,107.63
  Bottom 0.406: IC5.23 40.32,71.44 30.48,71.44 29.53,72.39 23.18,72.39 22.86,72.07 v21.59,72.07 | v17.78,107.63 14.92,110.49 14.92,120.65 21.59,120.65 BX2.34
BV1J  (via drill 0.81)
  Top 0.406: v56.52,68.58 56.83,68.9 v56.83,99.38
  Bottom 0.406: v56.52,68.58 IC5.5 | v56.83,99.38 55.56,100.65 44.45,100.65 43.18,101.92 28.26,101.92 26.67,103.5 26.67,105.41 21.59,105.41 BX1.36
BV2J  (via drill 0.81)
  Top 0.406: v15.56,70.8 14.61,71.75 14.61,107.63 18.73,111.76 18.73,120.33 BX2.36
  Bottom 0.406: IC5.24 40.32,68.26 30.16,68.26 29.53,67.63 18.73,67.63 v15.56,70.8
CLK  (via drill 0.81)
  Top 0.406: v46.35,59.69 52.07,59.69 52.07,72.71 52.7,73.34 52.7,74.3 52.39,74.61 52.39,78.11 52.07,78.42 52.07,86.04 v52.39,86.36
  Bottom 0.406: IC5.12 48.58,86.68 52.39,86.68 | 52.39,86.68 62.23,86.68 63.18,87.63 69.53,87.63 70.8,86.36 IC4.12 83.5,86.36 84.77,87.63 92.71,87.63 IC3.12 104.46,86.36 105.73,87.63 115.57,87.63 116.52,86.68 | IC1.12 135.89,90.17 120.02,90.17 116.52,86.68 | 116.52,86.68 IC2.12 | PC1.7 6.35,62.23 6.35,59.69 v46.35,59.69 | 52.39,86.68 v52.39,86.36
CS-N  (via drill 0.81)
  Top 0.406: v119.06,87.63 118.11,86.68 118.11,85.72 116.84,84.45 IC2.11 | v35.24,79.06 v35.24,65.72
  Bottom 0.406: IC2.11 115.57,82.55 95.25,82.55 IC3.11 92.71,82.55 83.19,82.55 82.87,82.87 70.17,82.87 | IC1.11 135.89,87.63 v119.06,87.63 | 49.53,82.55 IC5.11 | 49.53,82.55 69.85,82.55 70.17,82.87 | IC4.11 70.17,82.87 | PC1.5 12.38,65.72 v35.24,65.72 | v35.24,79.06 35.24,82.55 49.53,82.55
DGND  (via drill 0.81)
  Top 0.813: IC3.10 91.12,84.14 v91.12,96.84 | v129.54,92.71 v129.54,82.55 | C8.2 v53.34,81.28 | v65.72,81.28 65.09,81.92 65.09,91.76 63.82,93.03 61.28,93.03 | v61.28,81.28 61.28,93.03 | v32.07,74.61 33.97,72.71 33.97,61.28 X1.9 | PC1.10 PC1.12 PC1.14 PC1.16 PC1.18 PC1.20 PC1.22 PC1.24 | IC6.13 20.32,81.28 v20.32,92.71 | v61.28,96.84 61.28,93.03 | v86.36,94.3 82.55,90.49 v82.55,81.6
  Bottom 0.813: 129.54,93.03 140.02,93.03 141.29,91.76 141.29,81.28 IC1.10 | 129.54,93.03 113.03,93.03 108.9,97.16 91.44,97.16 v91.12,96.84 90.81,96.84 88.27,94.3 v86.36,94.3 | IC2.10 118.11,82.55 v129.54,82.55 | v129.54,92.71 129.54,93.03 | IC5.10 v53.34,81.28 v61.28,81.28 | v65.72,81.28 IC4.10 71.12,81.6 v82.55,81.6 | IC6.13 26.99,74.61 v32.07,74.61 | IC6.7 24.77,91.44 23.18,93.03 20.32,93.03 | 18.73,93.03 10.79,93.03 5.08,87.31 PC1.26 PC1.24 | 18.73,93.03 20.32,93.03 | v20.32,92.71 20.32,93.03 | v61.28,96.84 41.91,96.84 41.59,96.52 21.91,96.52 18.73,93.34 18.73,93.03
GND  (via drill 0.81)
  Top 0.813: v31.75,69.53 X1.8 31.75,49.85 25.08,43.18 C11.2 | REG1.4 17.78,41.91 C9.- | BX1.32 25.4,94.61 26.67,93.34 v26.67,71.12 | 47.78,39.85 45.72,41.91 C12.- | 47.78,39.85 REG2.4 | 47.78,39.85 47.94,40.01 47.94,52.39 C4.2 46.99,53.66 45.09,55.56 45.09,70.48 IC5.7 | UUT.NC@1 UUT.NC@2 UUT.NC@4 UUT.NC@3 | UUT.NC@5 UUT.NC@6 UUT.NC@7 UUT.NC@8 29.84,12.38 29.21,13.02 29.21,14.92 | 29.21,14.92 R12.1 R13.1 29.21,30.16 30.48,31.43 D2.A 30.8,31.75 30.8,44.77 R21.1 | GND.8 GND.7 GND.6 GND.5 GND.4 GND.3 GND.2 GND.1 | v58.42,119.38 BX2.6 | v133.35,108.27 133.35,120.65 AX2.6 | v82.55,102.55 87.31,107.31 87.31,114.94 87.95,115.57 89.85,115.57 v89.85,108.27 | R28.2 93.98,52.07 C7.2 92.71,53.66 89.85,56.52 89.85,62.55 IC3.25 | v133.67,57.15 133.67,61.91 IC1.26 131.76,63.5 v127.64,59.37 | IC2.1 116.84,54.61 C5.2 115.25,53.34 105.25,43.34 | 105.25,43.34 101.6,46.99 C18.+ | 105.25,43.34 109.22,39.37 L4.2 109.22,39.05 112.71,35.56 112.71,27.3 116.84,23.18 R11.1 | GNDL3.1 R5.1 109.22,13.02 116.84,20.64 R11.1 | R11.1 R10.1 124.46,17.78 GNDPROBE.1 | REG3.4 73.66,41.91 C15.- 73.66,43.5 71.44,45.72 71.44,51.75 C3.2 | C17.2 79.69,42.86 79.69,38.42 D3.A 86.36,31.43 80.33,25.4 80.33,14.61 78.74,13.02 R3.1 GNDL1.1 | GND0.1 46.99,6.35 C1.- 46.99,13.02 45.72,14.29 45.72,14.92 29.21,14.92 | GNDL2.1 R4.1 | GNDL0.1 R2.1 63.5,13.02 61.91,14.61 61.91,27.94 58.9,30.96 | 58.9,30.96 58.42,31.43 D1.A | v80.01,69.85 v80.01,101.92 | C10.- 6.03,34.61 6.03,47.94 R18.1 | 58.9,30.96 C16.- 61.91,34.29 61.91,39.69 63.5,41.27 R24.1
  Bottom 0.813: BX1.32 23.81,102.55 19.68,102.55 12.38,109.86 12.38,114.94 10.16,114.94 POWER.2 | v31.75,69.53 30.8,69.53 C2.2 v26.67,71.12 | R18.1 13.97,43.18 C9.- | REG1.4 C11.2 24.13,49.53 R21.1 41.91,43.18 C12.- | REG2.4 C14.2 | UUT.NC@2 13.97,5.71 UUT.NC@5 | R14.1 49.21,21.91 30.8,21.91 R13.1 | GND.2 v58.42,119.38 | AX1.32 100.01,102.55 95.89,102.55 94.93,103.5 94.93,108.27 | v133.35,108.27 94.93,108.27 | GND.8 75.25,102.55 80.01,102.55 | v82.55,102.55 80.01,102.55 | 94.93,108.27 v89.85,108.27 | v133.67,57.15 137.48,53.34 C6.2 | v127.64,59.37 126.68,58.42 IC2.1 | R28.2 95.25,48.26 C18.+ | C15.- C17.2 | C1.- R2.1 R3.1 R4.1 R5.1 | v80.01,69.85 83.82,66.04 IC3.25 | v80.01,101.92 80.01,102.55 | C13.- 31.75,31.75 D2.A
  pour Bottom (isolate 0.406): 307.34,152.4 154.94,152.4 154.94,0 307.34,0
  pour Top (isolate 0.406): 307.34,152.4 154.94,152.4 154.94,0 307.34,0
LED0
  Top 0.406: LED0.1 GREEN.A 54.61,19.05 54.61,29.53 50.8,33.34 50.8,55.88 IC5.1
LED1  (via drill 0.81)
  Top 0.406: LED1.1 RED1.A 69.85,19.05 69.85,39.69 68.58,40.96 68.58,57.47 v66.36,59.69
  Bottom 0.406: IC5.2 48.58,60.64 62.23,60.64 63.18,59.69 v66.36,59.69
LED2  (via drill 0.81)
  Top 0.406: YELLOW.A LED2.1 86.36,3.81 62.87,3.81 60.64,6.03 60.64,24.77 54.93,30.48 54.93,61.91 v53.34,63.5
  Bottom 0.406: v53.34,63.5 IC5.3
LED3  (via drill 0.81)
  Top 0.406: RED2.A LED3.1 101.6,2.86 56.2,2.86 54.61,4.45 54.61,7.62 43.81,18.41 v43.81,66.04
  Bottom 0.406: v43.81,66.04 IC5.4
N$1  (via drill 0.81)
  Top 0.406: ECS.AA1 EDAC.AA1 DEC.AA1 | v142.88,109.54 142.24,110.17 v142.24,135.57
  Bottom 0.406: AX1.1 142.56,109.54 v142.88,109.54 | v142.24,135.57 139.06,138.75 DEC.AA1
N$2  (via drill 0.81)
  Top 0.406: AX1.35 96.2,107 v96.2,110.81 | v92.39,111.76 91.12,113.03 91.12,119.06 87,123.19 87,135.57 83.82,138.75 EDAC.AV1 ECS.AV1
  Bottom 0.406: v96.2,110.81 95.25,111.76 v92.39,111.76
N$3  (via drill 0.81)
  Top 0.406: ECS.AU1 EDAC.AU1 DEC.AU1 | AX1.33 97.79,107.95 97.79,134.94 v96.52,136.21
  Bottom 0.406: v96.52,136.21 95.57,137.16 88.58,137.16 DEC.AU1
N$4  (via drill 0.81)
  Top 0.406: v101.6,117.79 AX1.31 | v92.39,119.06 90.17,121.28 EDAC.AT1 ECS.AT1
  Bottom 0.406: v101.6,117.79 100.33,119.06 v92.39,119.06
N$5  (via drill 0.81)
  Top 0.406: ECS.AS1 EDAC.AS1 DEC.AS1 93.34,123.83 v93.98,123.19 | v104.14,117.79 AX1.29
  Bottom 0.406: v104.14,117.79 101.28,120.65 100.97,120.65 100.33,121.28 100.33,123.19 v93.98,123.19
N$6  (via drill 0.81)
  Top 0.406: AX1.27 105.41,107.95 v105.41,110.81 | v95.25,113.03 95.25,139.06 EDAC.AR1 ECS.AR1
  Bottom 0.406: v105.41,110.81 97.79,110.81 95.57,113.03 v95.25,113.03
N$7  (via drill 0.81)
  Top 0.406: ECS.AP1 EDAC.AP1 DEC.AP1 100.33,138.11 100.33,101.92 v101.6,100.65 | AX1.25 109.54,106.36 109.54,105.73 110.49,104.78 v110.49,101.92
  Bottom 0.406: v110.49,101.92 109.22,100.65 v101.6,100.65
N$8  (via drill 0.81)
  Top 0.406: AX1.23 111.44,107 111.44,120.33 110.49,121.28 v110.49,130.81 | v104.14,133.67 102.87,134.94 EDAC.AN1 ECS.AN1
  Bottom 0.406: v110.49,130.81 107.63,133.67 v104.14,133.67
N$9  (via drill 0.81)
  Top 0.406: ECS.AM1 EDAC.AM1 DEC.AM1 105.41,138.11 v105.41,115.25 | AX1.21 112.71,108.27 v112.71,111.76
  Bottom 0.406: v112.71,111.76 109.22,115.25 v105.41,115.25
N$10  (via drill 0.81)
  Top 0.406: AX1.19 116.84,120.02 115.57,121.28 115.57,125.41 v114.3,126.68 | v109.22,128.27 EDAC.AL1 ECS.AL1
  Bottom 0.406: v114.3,126.68 112.71,128.27 v109.22,128.27
N$11  (via drill 0.81)
  Top 0.406: ECS.AK1 EDAC.AK1 DEC.AK1 113.03,138.11 v113.03,119.7 | v119.38,113.35 AX1.17
  Bottom 0.406: v113.03,119.7 v119.38,113.35
N$12  (via drill 0.81)
  Top 0.406: AX1.15 121.6,107 121.6,120.33 120.65,121.28 v120.65,134.94 | EDAC.AJ1 ECS.AJ1
  Bottom 0.406: v120.65,134.94 115.57,140.02 EDAC.AJ1
N$13  (via drill 0.81)
  Top 0.406: ECS.AH1 EDAC.AH1 DEC.AH1 | v124.46,119.7 AX1.13
  Bottom 0.406: v124.46,119.7 125.73,120.97 125.73,128.27 144.78,128.27 145.73,129.22 145.73,134.3 123.19,134.3 DEC.AH1
N$14  (via drill 0.81)
  Top 0.406: AX1.11 125.73,107.95 v125.73,113.67 | v123.19,116.2 123.19,135.57 121.92,136.84 EDAC.AF1 ECS.AF1
  Bottom 0.406: v123.19,116.2 v125.73,113.67
N$15
  Top 0.406: ECS.AE1 EDAC.AE1 DEC.AE1 125.73,138.11 125.73,121.28 127,120.02 127,109.22 AX1.9
N$16  (via drill 0.81)
  Top 0.406: v132.08,112.71 AX1.7 | v129.54,115.25 129.22,115.57 129.22,120.33 128.27,121.28 EDAC.AD1 ECS.AD1
  Bottom 0.406: v129.54,115.25 v132.08,112.71
N$17  (via drill 0.81)
  Top 0.406: ECS.AC1 EDAC.AC1 DEC.AC1 130.81,138.11 v130.81,119.38 | v134.62,115.57 AX1.5
  Bottom 0.406: v130.81,119.38 v134.62,115.57
N$18
  Top 0.406: AX1.3 137.16,120.02 135.89,121.28 135.89,125.09 134.62,126.36 EDAC.AB1 ECS.AB1
N$19
  Top 0.406: AX2.1 140.34,125.09 140.34,142.56 ECS.AA2 EDAC.AA2
N$20
  Top 0.406: DEC.AB2 EDAC.AB2 ECS.AB2 134.62,143.83 136.21,142.24 136.21,140.02 135.89,139.7 135.89,126.36 136.84,125.41 136.84,124.78 AX2.3
N$21
  Top 0.406: AX2.5 133.35,125.73 133.35,139.7 133.03,140.02 133.03,143.51 ECS.AC2 EDAC.AC2
N$22  (via drill 0.81)
  Top 0.406: DEC.AD2 EDAC.AD2 ECS.AD2 | v132.08,135.57 AX2.7
  Bottom 0.406: v132.08,135.57 128.91,138.75 127.95,138.75 126.68,140.02 126.68,145.1 ECS.AD2
N$23
  Top 0.406: AX2.9 129.86,124.78 129.86,148.59 128.59,149.86 120.33,149.86 120.33,144.78 121.6,143.51 125.09,143.51 ECS.AE2 EDAC.AE2
N$24
  Top 0.406: ECS.AF2 EDAC.AF2 DEC.AF2 125.41,148.27 126.68,147 126.68,124.78 AX2.11
N$25  (via drill 0.81)
  Top 0.406: AX2.13 124.14,124.78 v124.14,136.21 | ECS.AH2 EDAC.AH2
  Bottom 0.406: v124.14,136.21 120.33,140.02 120.33,145.1 ECS.AH2
N$26  (via drill 0.81)
  Top 0.406: DEC.AJ2 EDAC.AJ2 ECS.AJ2 115.57,143.83 117.16,142.24 117.16,129.22 v118.11,128.27
  Bottom 0.406: v118.11,128.27 AX2.15
N$27
  Top 0.406: AX2.17 119.38,137.48 120.33,138.43 120.33,142.24 119.06,143.51 117.16,143.51 117.16,148.59 115.89,149.86 112.39,149.86 EDAC.AK2 ECS.AK2
N$28
  Top 0.406: DEC.AL2 EDAC.AL2 ECS.AL2 109.22,143.51 112.71,143.51 113.98,142.24 113.98,131.13 116.52,128.59 116.52,124.78 AX2.19
N$29  (via drill 0.81)
  Top 0.406: v109.22,126.68 107.95,127.95 107.95,139.7 107.63,140.02 107.63,143.51 ECS.AM2 EDAC.AM2
  Bottom 0.406: AX2.21 112.08,126.68 v109.22,126.68
N$30  (via drill 0.81)
  Top 0.406: DEC.AN2 EDAC.AN2 ECS.AN2 | v111.76,136.21 AX2.23
  Bottom 0.406: v111.76,136.21 109.22,138.75 108.9,138.75 107.63,140.02 107.63,143.51 105.73,143.51 104.14,145.1 ECS.AN2
N$31  (via drill 0.81)
  Top 0.406: v102.87,127 101.28,128.59 101.28,143.51 ECS.AP2 EDAC.AP2
  Bottom 0.406: AX2.25 107.95,123.19 103.5,123.19 102.87,123.83 v102.87,127
N$32  (via drill 0.81)
  Top 0.406: DEC.AR2 EDAC.AR2 ECS.AR2 | v106.68,136.21 AX2.27
  Bottom 0.406: v106.68,136.21 104.46,138.43 104.46,143.51 98.11,143.51 ECS.AR2
N$33  (via drill 0.81)
  Top 0.406: v92.08,128.27 91.76,128.59 91.76,143.51 ECS.AS2 EDAC.AS2
  Bottom 0.406: AX2.29 104.14,128.27 v92.08,128.27
N$34  (via drill 0.81)
  Top 0.406: ECS.AT2 EDAC.AT2 DEC.AT2 86.68,148.27 85.41,147 85.41,138.43 87.95,135.89 87.95,127.95 v88.9,127
  Bottom 0.406: AX2.31 99.06,127 v88.9,127
N$35
  Top 0.406: AX2.33 98.74,124.78 98.74,137.79 98.11,138.43 98.11,148.59 96.84,149.86 91.76,149.86 91.76,144.78 90.49,143.51 87,143.51 ECS.AU2 EDAC.AU2
N$36  (via drill 0.81)
  Top 0.406: DEC.AV2 EDAC.AV2 ECS.AV2 82.23,143.51 82.23,129.22 v85.72,125.73
  Bottom 0.406: AX2.35 95.25,125.73 v85.72,125.73
N$37  (via drill 0.81)
  Top 0.406: v67.94,124.46 69.53,126.05 69.53,143.51 ECS.BA2 EDAC.BA2
  Bottom 0.406: v67.94,124.46 BX2.1
N$38
  Top 0.406: DEC.BB2 EDAC.BB2 ECS.BB2 63.18,143.51 63.18,126.68 BX2.3
N$39
  Top 0.406: BX2.5 58.74,124.78 58.74,137.79 60.01,139.06 60.01,143.51 ECS.BC2 EDAC.BC2
N$40
  Top 0.406: DEC.BD2 EDAC.BD2 ECS.BD2 56.83,143.51 56.83,138.43 56.2,137.79 56.2,124.78 BX2.7
N$41
  Top 0.406: BX2.9 53.66,124.78 53.66,143.51 ECS.BE2 EDAC.BE2
N$42  (via drill 0.81)
  Top 0.406: DEC.BF2 EDAC.BF2 ECS.BF2 | v50.8,137.16 BX2.11
  Bottom 0.406: v50.8,137.16 53.66,140.02 53.66,145.1 ECS.BF2
N$43
  Top 0.406: BX2.13 48.26,136.21 50.48,138.43 50.48,143.51 ECS.BH2 EDAC.BH2
N$44
  Top 0.406: DEC.BJ2 EDAC.BJ2 ECS.BJ2 47.31,143.51 47.31,126.05 BX2.15
N$45
  Top 0.406: BX2.17 43.5,124.78 43.5,137.79 44.13,138.43 44.13,143.51 ECS.BK2 EDAC.BK2
N$46
  Top 0.406: DEC.BL2 EDAC.BL2 ECS.BL2 40.96,143.51 40.96,124.78 BX2.19
N$47
  Top 0.406: BX2.21 37.78,124.78 37.78,143.51 ECS.BM2 EDAC.BM2
N$48
  Top 0.406: DEC.BN2 EDAC.BN2 ECS.BN2 34.61,143.51 34.61,138.43 35.24,137.79 35.24,124.78 BX2.23
N$49
  Top 0.406: BX2.25 32.7,124.78 32.7,137.79 31.43,139.06 31.43,143.51 ECS.BP2 EDAC.BP2
N$50
  Top 0.406: DEC.BR2 EDAC.BR2 ECS.BR2 28.26,143.51 28.26,138.43 30.16,136.53 30.16,124.78 BX2.27
N$51
  Top 0.406: BX2.29 27.62,124.78 27.62,136.53 25.08,139.06 25.08,143.51 ECS.BS2 EDAC.BS2
N$52  (via drill 0.81)
  Top 0.406: DEC.BT2 EDAC.BT2 ECS.BT2 | BX2.31 25.08,124.78 v25.08,133.99
  Bottom 0.406: v25.08,133.99 25.08,143.51 21.91,143.51 ECS.BT2
N$53  (via drill 0.81)
  Top 0.406: v22.86,135.89 BX2.33 | ECS.BU2 EDAC.BU2
  Bottom 0.406: v22.86,135.89 18.73,140.02 18.73,145.1 ECS.BU2
N$54
  Top 0.406: DEC.BV2 EDAC.BV2 ECS.BV2 13.97,143.51 17.46,143.51 18.73,142.24 18.73,126.05 BX2.35
N$55  (via drill 0.81)
  Top 0.406: ECS.BA1 EDAC.BA1 DEC.BA1 66.67,137.48 66.67,107.31 v66.04,106.68
  Bottom 0.406: v66.04,106.68 BX1.1
N$56  (via drill 0.81)
  Top 0.406: BX1.3 63.5,109.22 v63.5,116.52 | v65.09,118.11 64.77,118.43 EDAC.BB1 ECS.BB1
  Bottom 0.406: v65.09,118.11 v63.5,116.52
N$57
  Top 0.406: ECS.BC1 EDAC.BC1 DEC.BC1 59.69,136.84 59.69,107.95 BX1.5
N$58
  Top 0.406: BX1.7 55.88,120.02 57.15,121.28 57.15,137.48 58.42,138.75 EDAC.BD1 ECS.BD1
N$59
  Top 0.406: ECS.BE1 EDAC.BE1 DEC.BE1 54.61,138.11 54.61,107.95 BX1.9
N$60
  Top 0.406: BX1.11 50.8,120.02 52.07,121.28 EDAC.BF1 ECS.BF1
N$61  (via drill 0.81)
  Top 0.406: ECS.BH1 EDAC.BH1 DEC.BH1 | BX1.13 49.53,107.95 v49.53,135.89
  Bottom 0.406: v49.53,135.89 49.53,138.75 DEC.BH1
N$62
  Top 0.406: BX1.15 45.72,120.02 44.45,121.28 44.45,137.48 45.72,138.75 EDAC.BJ1 ECS.BJ1
N$63
  Top 0.406: ECS.BK1 EDAC.BK1 DEC.BK1 41.91,138.11 41.91,107.95 BX1.17
N$64
  Top 0.406: BX1.19 40.32,107 40.32,120.33 39.37,121.28 EDAC.BL1 ECS.BL1
N$65
  Top 0.406: ECS.BM1 EDAC.BM1 DEC.BM1 36.83,138.11 36.83,119.38 38.1,118.11 BX1.21
N$66
  Top 0.406: BX1.23 35.56,120.02 34.29,121.28 34.29,137.48 33.02,138.75 EDAC.BN1 ECS.BN1
N$67
  Top 0.406: ECS.BP1 EDAC.BP1 DEC.BP1 31.75,136.84 31.75,107.95 BX1.25
N$68
  Top 0.406: BX1.27 29.21,107.95 29.21,136.21 26.67,138.75 EDAC.BR1 ECS.BR1
N$69
  Top 0.406: ECS.BS1 EDAC.BS1 DEC.BS1 23.5,137.16 26.67,133.99 26.67,121.28 27.62,120.33 27.62,107 BX1.29
N$70
  Top 0.406: BX1.31 21.59,110.49 21.59,126.68 20.32,127.95 EDAC.BT1 ECS.BT1
N$71  (via drill 0.81)
  Top 0.406: ECS.BU1 EDAC.BU1 DEC.BU1 v17.14,112.39
  Bottom 0.406: v17.14,112.39 BX1.33
N$72
  Top 0.406: EDAC.BV1 ECS.BV1
  Bottom 0.406: BX1.35 20,106.36 17.46,106.36 13.97,109.86 13.97,130.81 6.99,130.81 6.35,131.44 6.35,140.34 EDAC.BV1
N$73
  Bottom 0.406: GREEN.K 58.42,22.86 R2.2
N$74
  Top 0.406: RED1.K 78.74,20.32 R3.2
N$75
  Bottom 0.406: YELLOW.K 88.9,22.86 R4.2
N$76
  Bottom 0.406: RED2.K 104.14,22.86 R5.2
N$77
  Top 0.406: R7.1 R6.1 LOADL3.1
N$78
  Top 0.406: R9.1 R8.1 LOADL1.1
N$79
  Top 0.406: LOADHI1.1 R11.2
N$80
  Top 0.406: LOADHI3.1 R10.2
N$81
  Top 0.406: IC3.23 R17.1
N$82
  Top 0.406: UUT_PWR.K R13.2 R12.2
N$83
  Bottom 0.406: R14.2 PWR.K
N$84
  Top 0.813: X1.2 15.56,60.01 15.56,25.72 20.64,20.64 20.64,9.21 UUT.2
N$86
  Top 0.406: REG1.2 D2.C 25.4,34.29 L1.1
N$87
  Top 0.406: REG1.1 R20.2 | REG1.7 REG1.8
  Bottom 0.406: REG1.8 REG1.1
N$88
  Top 0.406: R18.2 R19.1 REG1.5
N$90
  Bottom 0.406: REG1.3 26.67,43.18 C11.1
N$91
  Top 0.406: REG4.2 D4.C 109.22,34.29 L4.1
N$92
  Top 0.406: REG2.2 D1.C
  Bottom 0.406: D1.C 53.34,34.29 L2.1
N$93
  Top 0.406: REG2.1 R23.2 | REG2.7 REG2.8
  Bottom 0.406: REG2.8 REG2.1
N$94
  Top 0.406: R21.2 R22.1 REG2.5
N$95
  Bottom 0.406: REG2.3 54.61,43.18 C14.1
N$96
  Top 0.406: R29.2 REG4.1 REG4.8 REG4.7
N$97
  Top 0.406: REG3.2 D3.C 81.28,34.29 L3.1
N$98
  Top 0.406: REG3.1 R26.2 | REG3.7 REG3.8
  Bottom 0.406: REG3.8 REG3.1
N$99
  Top 0.406: R24.2 R25.1 REG3.5
N$100
  Top 0.406: REG3.3 78.42,39.05 78.42,45.4 81.28,48.26 85.09,48.26 C17.1
N$101
  Top 0.406: R27.2 R28.1 REG4.5
N$102
  Bottom 0.406: REG4.3 110.49,43.18 C20.1
N$103
  Top 0.406: REG5.2 D5.C 137.16,34.29 L5.1
N$104
  Top 0.406: REG5.1 R32.2 | REG5.7 REG5.8
  Bottom 0.406: REG5.8 REG5.1
N$105
  Top 0.406: R30.2 R31.1 REG5.5
N$106
  Top 0.406: REG5.3 140.97,36.83 C23.1
N$107
  Bottom 0.406: R1.1 129.54,58.42 IC1.28
PROBE1  (via drill 0.81)
  Top 0.406: v36.2,63.5 35.56,62.87 35.56,51.12 27.94,43.5 v27.94,26.35
  Bottom 0.406: IC5.25 38.73,66.04 v36.2,63.5 | v27.94,26.35 30.16,24.13 73.98,24.13 75.25,22.86 77.15,22.86 79.69,25.4 PROBE1.1
PROBE2  (via drill 0.81)
  Top 0.406: IC5.26 38.1,60.96 38.1,53.66 36.83,52.39 36.83,42.23 34.29,39.69 34.29,38.42 39.37,33.34 v39.37,26.35
  Bottom 0.406: v39.37,26.35 73.66,26.35 75.25,27.94 101.92,27.94 103.5,26.35 138.43,26.35 144.78,32.7 PROBE2.1
PROBE3  (via drill 0.81)
  Top 0.406: IC5.27 39.37,59.69 v39.37,47.94
  Bottom 0.406: v39.37,47.94 41.59,45.72 58.1,45.72 63.18,50.8 92.39,50.8 93.98,52.39 109.86,52.39 111.44,50.8 144.15,50.8 146.05,48.9 146.05,40.64 PROBE3.1
PROBE4  (via drill 0.81)
  Top 0.406: v40.64,42.55 IC5.28
  Bottom 0.406: v40.64,42.55 47.62,35.56 57.15,35.56 60.33,32.38 67.63,32.38 68.26,33.02 87.63,33.02 88.27,32.38 95.57,32.38 96.2,33.02 106.05,33.02 119.38,46.35 142.88,46.35 PROBE4.1
RESET-N  (via drill 0.81)
  Top 0.406: PC1.3 12.06,62.87 v12.06,77.15
  Bottom 0.406: IC1.18 118.43,83.82 117.16,85.09 115.89,85.09 114.62,83.82 IC2.18 107.95,85.09 87.63,85.09 IC3.18 72.71,83.82 71.44,85.09 68.58,85.09 67.31,83.82 IC4.18 C8.1 52.07,85.09 47.94,85.09 46.67,83.82 IC5.18 35.24,83.82 33.97,82.55 17.46,82.55 v12.06,77.15
SI-A  (via drill 0.81)
  Top 0.406: v137.16,91.44 137.48,91.76 137.48,102.55 138.43,103.5 138.43,137.48 139.38,138.43 139.38,142.24 138.11,143.51 136.21,143.51 136.21,148.59 133.99,150.81 6.35,150.81 6.35,135.25 3.81,132.72 3.81,65.41 4.45,64.77 7.62,64.77 PC1.9
  Bottom 0.406: v137.16,91.44 IC1.13
SI-B  (via drill 0.81)
  Top 0.406: v92.39,101.92 v92.39,95.89 | v86.04,108.27 82.55,111.76 82.55,126.68 78.74,130.49 78.74,137.79 66.67,149.86 8.89,149.86 8.89,130.18 6.35,127.64 6.35,69.85 PC1.11
  Bottom 0.406: IC2.13 116.2,89.53 110.17,89.53 109.54,90.17 102.87,90.17 97.16,95.89 v92.39,95.89 | v86.04,108.27 v92.39,101.92
SI-C  (via drill 0.81)
  Top 0.406: v101.6,87.63 101.28,87.31 101.28,64.77 96.2,59.69 91.12,59.69 91.12,62.87 86.68,67.31 82.23,67.31 v82.23,63.5
  Bottom 0.406: IC3.13 95.25,87.63 v101.6,87.63 | v82.23,63.5 81.92,63.82 74.93,63.82 71.44,67.31 53.98,67.31 53.66,67.63 48.9,67.63 48.58,67.31 30.48,67.31 29.84,66.67 12.06,66.67 PC1.13
SI-D
  Bottom 0.406: IC4.13 72.39,90.17 72.39,98.11 41.91,98.11 41.59,97.79 13.02,97.79 3.81,88.58 3.81,74.93 6.35,74.93 PC1.15
SI-E  (via drill 0.81)
  Top 0.406: v12.38,90.17 9.84,87.63 9.84,78.42 PC1.17
  Bottom 0.406: IC5.13 46.99,90.17 v12.38,90.17
SO-A  (via drill 0.81)
  Top 0.406: IC6.1 27.94,73.66 v27.94,48.26 | v140.65,96.52 139.7,95.57 IC1.14
  Bottom 0.406: v27.94,48.26 35.56,40.64 40.96,40.64 46.99,34.61 46.99,33.02 48.58,33.02 49.53,32.07 49.53,30.48 119.06,30.48 124.14,35.56 126.68,35.56 131.76,40.64 142.88,40.64 144.15,39.37 146.05,39.37 150.81,44.13 150.81,96.52 v140.65,96.52
SO-AN
  Bottom 0.406: IC6.2 28.89,80.33 23.5,80.33 23.18,80.01 16.51,80.01 8.89,72.39 4.45,72.39 3.81,71.75 3.81,58.42 PC1.4
SO-B  (via drill 0.81)
  Top 0.406: v53.66,74.93 53.66,69.85 53.34,69.53 v53.34,66.36 | v69.22,62.23 76.2,62.23 v76.2,53.66 | v90.49,52.07 92.71,49.85 92.71,49.21 93.66,48.26 99.69,48.26 99.69,55.56 108.9,64.77 111.12,64.77 v111.12,90.81
  Bottom 0.406: IC6.3 36.83,74.93 v53.66,74.93 | v53.34,66.36 54.93,64.77 66.67,64.77 v69.22,62.23 | v76.2,53.66 77.79,52.07 v90.49,52.07 | v111.12,90.81 111.76,91.44 IC2.14
SO-BN
  Bottom 0.406: IC6.4 29.21,85.09 8.89,85.09 PC1.25
SO-C
  Bottom 0.406: IC6.5 31.75,87.63 60.64,87.63 63.18,90.17 68.26,90.17 70.8,87.63 83.5,87.63 86.04,90.17 92.71,90.17 IC3.14
SO-CN  (via drill 0.81)
  Top 0.406: v12.38,87.63 11.11,86.36 v11.11,83.82
  Bottom 0.406: IC6.6 29.21,87.63 v12.38,87.63 | PC1.23 v11.11,83.82
SO-D  (via drill 0.81)
  Top 0.406: IC6.9 21.59,90.17 v21.59,94.3
  Bottom 0.406: v21.59,94.3 22.54,95.25 47.62,95.25 47.94,95.57 66.99,95.57 IC4.14
SO-DN  (via drill 0.81)
  Top 0.406: v11.43,91.44 8.89,88.9 8.89,80.01 PC1.19
  Bottom 0.406: v11.43,91.44 IC6.8
SO-E  (via drill 0.81)
  Top 0.406: IC6.11 24.13,85.09 v24.13,93.98 | IC5.14 v48.26,94.3
  Bottom 0.406: v24.13,93.98 24.45,94.3 v48.26,94.3
SO-EN
  Bottom 0.406: IC6.10 9.53,86.36 8.26,87.63 6.99,87.63 6.35,87 6.35,81.28 PC1.21
VDD  (via drill 0.81)
  Top 0.813: IC3.15 IC3.16 IC3.17 | IC4.9 73.34,80.96 v73.34,85.09 | v104.14,87.63 v104.14,78.74 | IC2.17 IC2.16 IC2.15 | IC1.17 IC1.16 IC1.15 | C5.1 114.3,57.15 v114.3,76.2 v114.3,85.09 | C6.1 128.59,58.1 126.05,58.1 v126.05,73.66 | v119.06,85.09 118.43,84.45 118.43,80.33 IC2.9 | IC4.17 IC4.16 IC4.15 | IC5.17 IC5.16 IC5.15 | v44.13,85.09 v44.13,78.74 | C2.1 23.81,71.44 23.81,75.25 IC6.14 22.86,76.52 25.4,79.06 v25.4,92.71 | v29.21,68.9 X1.7 v29.21,54.29 | PWR.A 42.23,17.78 42.23,53.02 C4.1 | v66.99,85.09 v66.99,80.01
  Bottom 0.813: v73.34,85.09 85.09,85.09 IC3.17 | v104.14,78.74 IC3.9 | IC2.16 105.41,88.9 v104.14,87.63 103.82,87.63 98.42,93.03 87.95,93.03 IC3.15 | IC1.9 IC1.17 131.76,86.36 130.49,85.09 v119.06,85.09 | v114.3,76.2 IC2.9 120.97,78.74 v126.05,73.66 | IC2.17 110.49,85.09 v114.3,85.09 | v44.13,78.74 IC5.9 | v44.13,85.09 42.86,86.36 IC5.17 | IC4.15 61.91,93.03 42.23,93.03 IC5.15 40.32,91.44 38.73,93.03 25.72,93.03 v25.4,92.71 | C7.1 85.72,53.34 84.14,54.93 66.36,54.93 C3.1 64.45,53.34 64.14,53.02 48.58,53.02 47.31,51.75 43.81,51.75 42.23,53.34 C4.1 30.16,53.34 v29.21,54.29 | v29.21,68.9 28.26,69.85 25.4,69.85 C2.1 | IC4.9 69.85,80.01 v66.99,80.01 | v66.99,85.09 65.72,86.36 IC4.17
VPP  (via drill 0.81)
  Top 0.813: VPP.8 VPP.7 VPP.6 VPP.5 VPP.4 VPP.3 VPP.2 VPP.1 | v139.7,109.54 AX2.2 | VPP0.1 41.91,6.35 C1.+ | R6.2 R7.2 R8.2 R9.2 127.32,25.08 127.32,53.02 | R1.2 127.32,53.34 127.32,53.02 | R17.2 84.45,60.33 v84.45,58.42 | v147,114.62 147,48.26 145.41,46.67 131.76,46.67 131.76,48.9 127.64,53.02 127.32,53.02
  Bottom 0.813: BX2.2 71.44,121.92 73.03,123.51 74.3,123.51 75.88,121.92 VPP.1 | v139.7,109.54 81.6,109.54 VPP.6 | 18.89,14.13 24.13,8.89 UUT.3 | 18.89,14.13 UUT_PWR.A | 18.89,14.13 19.05,14.29 40.32,14.29 C1.+ 42.23,12.7 45.72,16.19 122.87,16.19 R9.2 | v84.45,58.42 86.68,56.2 116.52,56.2 R1.2 | v147,114.62 AX2.2

## Text on the board
Top: ON | -
tPlace: BV | BA | AV | AA | M/R Series Flip-Chip Tester | Design by Warren Stearns